# Altium schematic sheet dcdc_wide_3v3.SchDoc
size 379 x 125 mm; SheetNumber: 1; SheetTotal: 1
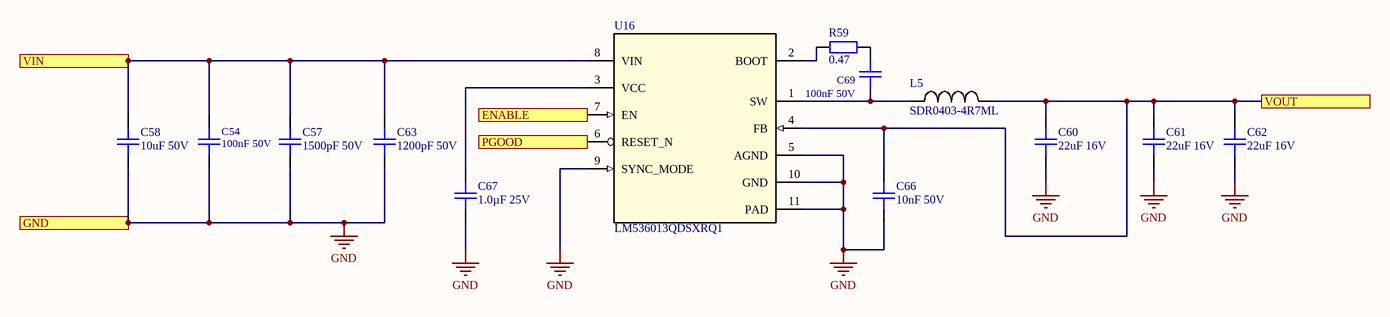
[diagram p0: dcdc_wide_3v3.SchDoc]

## Parts
C54  100nF 50V  [0805C]
C57  1500pF 50V  [0402C]
C58  10uF 50V  [CAPC3225X279X50LL20T25]
C60  22uF 16V  [1210C]
C61  22uF 16V  [1210C]
C62  22uF 16V  [1210C]
C63  1200pF 50V  [0402C]
C66  10nF 50V  [0402C]
C67  1.0µF 25V  [0603C]
C69  100nF 50V  [0805C]
L5  SDR0403-4R7ML  [SDR0403]
R59  0.47  [0402R]
U16  LM536013QDSXRQ1  [DSX0010A]

## Ports
ENABLE, GND, PGOOD, VIN, VOUT

## Nets
GND: C54.1 C57.1 C58.1 C60.1 C61.1 C62.1 C63.1 C66.1 C67.1 U16.5(AGND) U16.9(SYNC_MODE) U16.10(GND) U16.11(PAD) ; port GND
ENABLE: U16.7(EN) ; port ENABLE
PGOOD: U16.6(RESET_N) ; port PGOOD
VIN: C54.2 C57.2 C58.2 C63.2 U16.8(VIN) ; port VIN
VOUT: C60.2 C61.2 C62.2 C66.2 L5.2 U16.4(FB) ; port VOUT
NetC67_2: C67.2 U16.3(VCC)
NetC69_1: C69.1 L5.1 U16.1(SW)
NetC69_2: C69.2 R59.2
NetR59_1: R59.1 U16.2(BOOT)

## Library data of the parts
C54 = gen_C_ceramic_100n_50V_X7R_0805: Ceramic, 100nF, ±20%, 50V, X7R, –55 to 125°C, 0805 (2012),RoHS, Automotive; Manufacturer: Murata; Capacitance: 100n; Case EIA: 0805; Case Metric: 2012; Automotive Qualified: True; PnP Package: C_0805_10; Tolerance: ±10%; Dielectric: X7R; Rated Voltage: 50V; Height - Seated (Max): 0.8mm; Mounting Type: SurfaceMount,MLCC; Operating Temperature: –55 to 125°C; Series: GCJ; Supplier 1: Element14; Supplier Part Number 1: 8820120
C57 = gen_C_ceramic_390p_25V_C0G_0402: Ceramic, 390pF, ±5%, 25V, C0G, 25 to 125°C, 0402 (1005),RoHS, Automotive; Manufacturer: Murata; Capacitance: 1500p; Case EIA: 0402; Case Metric: 1005; Automotive Qualified: True; PnP Package: C_0402_10; PnP Value: 1500p/50V/C0G; Rated Voltage: 50V; Dielectric: C0G; Supplier 1: Digi-Key; Height - Seated (Max): 0.5mm; Mounting Type: SurfaceMount,MLCC; Operating Temperature: 25 to 125°C; Series: GCM; Tolerance: ±5%
C58 = gen_C_ceramic_10u_50V_X7R_1210: Ceramic, 10uF, 50 V, -55 to 125 degC, 2-Pin SMD (1210), RoHS, Tape and Reel; Manufacturer: AVX; Manufacturer 1: Kyocera AVX; Manufacturer Part Number 1: 12105C106KAT2A; Dielectric: X7R; Tolerance: ±10%; Load Life: 1000h; Type: CommercialSurfaceMountChip; Temperature Coefficient / Code: +/-15%; Case EIA: 1210; Case Metric: 3225; PnP Package: C_1210_10; PnP Value: 10µF/25V/X7R; Rated Voltage: 25V; Maximum Operating Temperature: +125C; Mounting Technology: SurfaceMount; Case Code - in: 1210; Package Description: 2-Pin Surface Mount Device, Body 3.2 x 2.5 mm; Datasheet URL: http://www.farnell.com/datasheets/1818074.pdf; Case Code - mm: 3225; Package / Case: 1210(3225metric); Product: GeneralTypeMLCCs; Capacitance: 10uF; Product Category: MultilayerCeramicCapacitorsMLCC-SMD/SMT; Minimum Operating Temperature: -55C; Manufacturer URL: http://www.avx.com/; Operating Temperature Range: -55Cto+125C; Termination Style: SMD/SMT; Voltage Rating: 50V; Factory Pack Quantity: 1000; RoHS: Details; Brand: AVX; Datasheet Version: 03/2014; Package Reference: 1210; Packaging: Reel; Voltage Rating DC: 50V; Height - Seated (Max): 2.5mm; Mounting Type: SurfaceMount,MLCC; Operating Temperature: –55 to 125°C; Series: GCM
C60-C62 = gen_C_ceramic_22u_16V_X7R_1210: Ceramic, 22uF, 16 V, -55 to 125 degC, 2-Pin SMD (1210), RoHS, Tape and Reel; Manufacturer: AVX; Manufacturer 1: Kyocera AVX; Manufacturer Part Number 1: 12105C106KAT2A; Dielectric: X7R; Tolerance: ±10%; Capacitance: 10uF; Load Life: 1000h; Type: CommercialSurfaceMountChip; Voltage Rating: 50V; Temperature Coefficient / Code: +/-15%; Case EIA: 1210; Case Metric: 3225; PnP Package: C_1210_10; PnP Value: 22µF/16V/X7R; Maximum Operating Temperature: +125C; Mounting Technology: SurfaceMount; Case Code - in: 1210; Package Description: 2-Pin Surface Mount Device, Body 3.2 x 2.5 mm; Datasheet URL: http://www.farnell.com/datasheets/1818074.pdf; Case Code - mm: 3225; Package / Case: 1210(3225metric); Product: GeneralTypeMLCCs; Product Category: MultilayerCeramicCapacitorsMLCC-SMD/SMT; Minimum Operating Temperature: -55C; Manufacturer URL: http://www.avx.com/; Operating Temperature Range: -55Cto+125C; Termination Style: SMD/SMT; Factory Pack Quantity: 1000; RoHS: Details; Brand: AVX; Datasheet Version: 03/2014; Package Reference: 1210; Packaging: Reel; Voltage Rating DC: 50V; Height - Seated (Max): 2.5mm; Mounting Type: SurfaceMount,MLCC; Operating Temperature: –55 to 125°C; Rated Voltage: 16V; Series: GCM
C63 = gen_C_ceramic_390p_25V_C0G_0402: Ceramic, 390pF, ±5%, 50V, C0G, 25 to 125°C, 0402 (1005),RoHS, Automotive; Manufacturer: Murata; Capacitance: 1200p; Case EIA: 0402; Case Metric: 1005; Automotive Qualified: True; PnP Package: C_0402_10; PnP Value: 1200pF/50V/C0G; Rated Voltage: 50V; Dielectric: C0G; Supplier 1: Digi-Key; Height - Seated (Max): 0.5mm; Mounting Type: SurfaceMount,MLCC; Operating Temperature: 25 to 125°C; Series: GCM; Tolerance: ±5%
C66 = gen_C_ceramic_10n_50V_X7R_0402: Ceramic, 10nF, ±10%, 50V, X7R, –55 to 125°C, 0402 (1005),RoHS, Automotive; Part Number: GRT155R71H104KE01; Automotive Qualified: True; Capacitance: 10n; Case EIA: 0402; Case Metric: 1005; PnP Package: C_0402_10; PnP Value: 10n/50V/X7R; Dielectric: X7R; Rated Voltage: 50V
C67 = gen_C_ceramic_1u_25V_X7R_0603: Ceramic, 1.0µF, ±10%, 25V, X7R, –55 to 125°C, 0603 (1608),RoHS, Automotive; Part Number: GCJ188R71E105KA01; Manufacturer: Murata; Case EIA: 0603; Case Metric: 1608; Capacitance: 1µF; Automotive Qualified: True; PnP Package: C_0603_10; PnP Value: 1.0µF/25V/X7R; Dielectric: X7R; Rated Voltage: 25V; Height - Seated (Max): 0.8mm; Mounting Type: SurfaceMount,MLCC; Operating Temperature: –55 to 125°C; Series: GCJ; Tolerance: ±10%; Manufacturer_Part_Number: GCJ188R71E105KA01; Supplier 1: Digi-Key; Supplier Part Number 1: 490-14409-1-ND
C69 = gen_C_ceramic_100n_50V_X7R_0805: Ceramic, 100nF, ±20%, 50V, X7R, –55 to 125°C, 0805 (2012),RoHS, Automotive; Part Number: GCJ188R71H104KA12; Manufacturer: Murata; Capacitance: 100n; Case EIA: 0603; Case Metric: 1608; Automotive Qualified: True; PnP Package: C_0603_10; PnP Value: 100nF/50V/X7R; Tolerance: ±10%; Dielectric: X7R; Rated Voltage: 50V; Height - Seated (Max): 0.8mm; Mounting Type: SurfaceMount,MLCC; Operating Temperature: –55 to 125°C; Series: GCJ; Manufacturer_Part_Number: GCJ188R71H104KA12; Supplier 1: Digi-Key; Supplier Part Number 1: 490-5798-1-ND
L5 = SDR0403-4R7ML: 4.7uH; Vendor: Bourns; Manufacturer_Part_Number: SDR0403-4R7ML; Manufacturer_Name: Bourns; RefDes: RefDes; TYPE: TYPE; Value: Value
R59 = gen_R_0R_0402: SMD Resistor 0R47 0402; Part Number: gen_R_0R47_0402; Case EIA: 0402; Case Metric: 1005; PnP Package: R_0402; Automotive Qualified: False; PnP Value: 0R47; Operating Temperature: -55°C - +155°C
U16 = LM536013QDSXRQ1: Imported; Manufacturer: Texas Instruments; CompType: IC; PIN_COUNT: 11; Application_BuildNumber: *; PartNumber: LM536013QDSXRQ1; PackageReference: DSX0010A; MountType: SMT; RoHS: Y; RefDes: RefDes; TYPE: TYPE; Value: Value; Manufacturer_Part_Number: LM536013QDSXRQ1; Manufacturer_Name: Texas Instruments